# EAGLE design polarshield v1.4a (EAGLE 6.4)
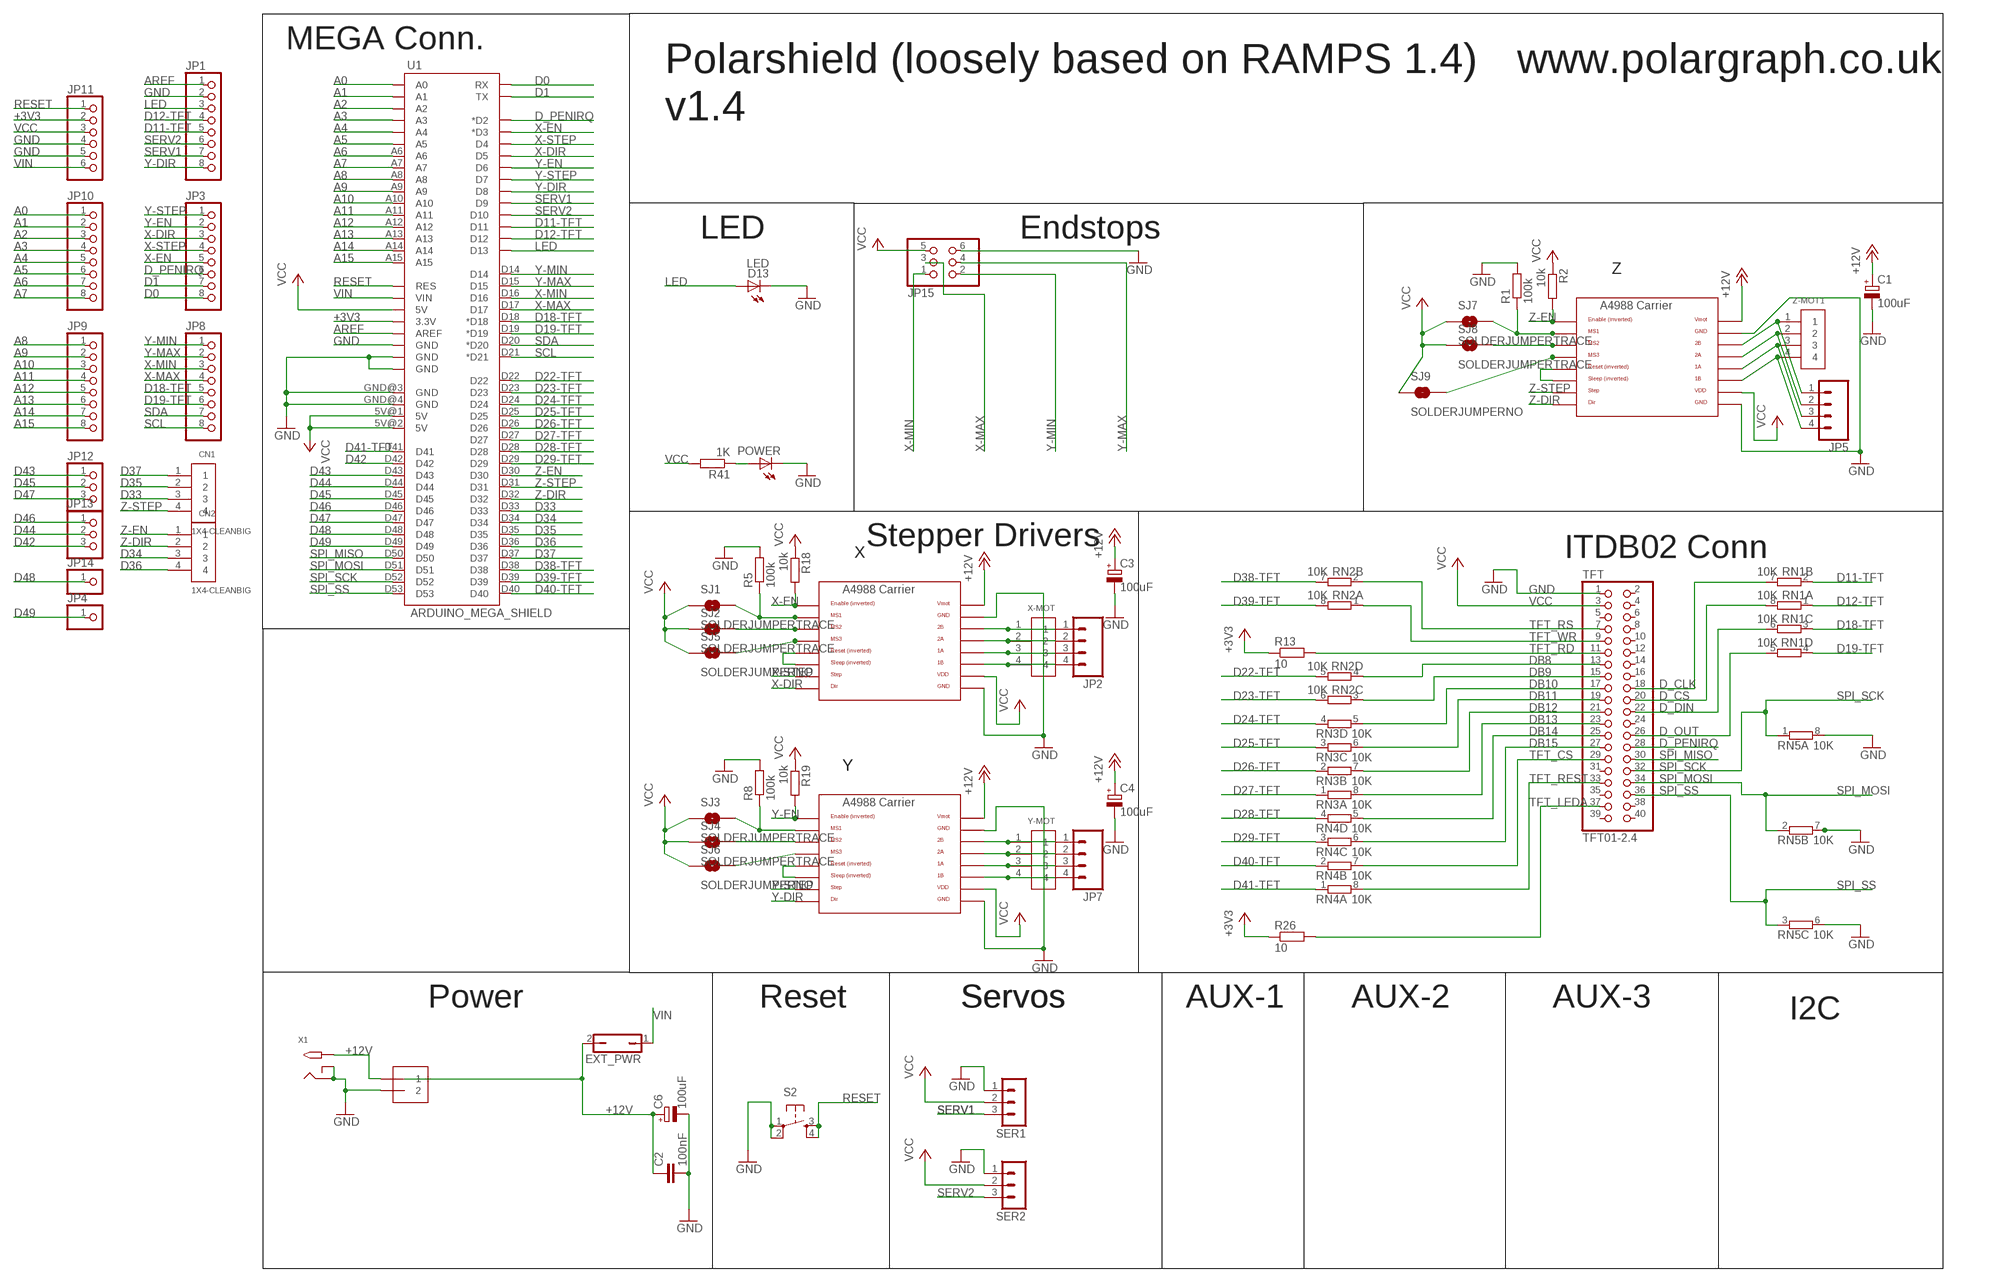
[diagram p0: schematic, sheet 1]

## Parts
C1  100uF  CPOL-EU153CLV-0605  [153CLV-0605]
C2  100nF  C-EUC0805  [C0805]
C3  100uF  CPOL-EU153CLV-0605  [153CLV-0605]
C4  100uF  CPOL-EU153CLV-0605  [153CLV-0605]
C6  100uF  CPOL-EU153CLV-0605  [153CLV-0605]
CN1  1X4-CLEANBIG  [1X04-CLEANBIG]
CN2  1X4-CLEANBIG  [1X04-CLEANBIG]
D13  LED  LEDCHIP-LED0805  [CHIP-LED0805]
EXT_PWR  JP1Q  [JP1]
J1  1X2-3.5MM  [1X2-3.5MM]
JP1  PINHD-1X8CLEANBIG  [1X08-CLEANBIG]
JP2  M04SCREW  [SCREWTERMINAL-3.5MM-4]
JP3  PINHD-1X8CLEANBIG  [1X08-CLEANBIG]
JP4  PINHD-1X1CB  [1X01-CLEANBIG]
JP5  M04SCREW  [SCREWTERMINAL-3.5MM-4]
JP7  M04SCREW  [SCREWTERMINAL-3.5MM-4]
JP8  PINHD-1X8CLEANBIG  [1X08-CLEANBIG]
JP9  PINHD-1X8CLEANBIG  [1X08-CLEANBIG]
JP10  PINHD-1X8CLEANBIG  [1X08-CLEANBIG]
JP11  PINHD-1X6CB  [1X06-CLEANBIG]
JP12  PINHD-1X3CB  [1X03-CLEANBIG]
JP13  PINHD-1X3CB  [1X03-CLEANBIG]
JP14  PINHD-1X1CB  [1X01-CLEANBIG]
JP15  PINHD-2X3  [2X03]
POWER  LEDCHIP-LED0805  [CHIP-LED0805]
R1  100k  R-EU_R0805  [R0805]
R2  10k  R-EU_R0805  [R0805]
R5  100k  R-EU_R0805  [R0805]
R8  100k  R-EU_R0805  [R0805]
R13  10  R-EU_R0805  [R0805]
R18  10k  R-EU_R0805  [R0805]
R19  10k  R-EU_R0805  [R0805]
R26  10  R-EU_R0805  [R0805]
R41  1K  R-EU_R0805  [R0805]
RN1  10K  4R-NEXBS8V  [EXBS8V]
RN2  10K  4R-NEXBS8V  [EXBS8V]
RN3  10K  4R-NEXBS8V  [EXBS8V]
RN4  10K  4R-NEXBS8V  [EXBS8V]
RN5  10K  4R-NEXBS8V  [EXBS8V]
S2  TAC_SWITCHPTH  [TACTILE-PTH]
SER1  3PIN-HEADER  [3PIN-HEADER]
SER2  3PIN-HEADER  [3PIN-HEADER]
SJ1  SOLDERJUMPERTRACE  [SJ_2S-TRACE]
SJ2  SOLDERJUMPERTRACE  [SJ_2S-TRACE]
SJ3  SOLDERJUMPERTRACE  [SJ_2S-TRACE]
SJ4  SOLDERJUMPERTRACE  [SJ_2S-TRACE]
SJ5  SOLDERJUMPERNO  [SJ_2S-NO]
SJ6  SOLDERJUMPERNO  [SJ_2S-NO]
SJ7  SOLDERJUMPERTRACE  [SJ_2S-TRACE]
SJ8  SOLDERJUMPERTRACE  [SJ_2S-TRACE]
SJ9  SOLDERJUMPERNO  [SJ_2S-NO]
TFT  TFT01-2.4  [TFT01-2.4]
U1  ARDUINO_MEGA_SHIELD  [ARDUINO_MEGA_SHIELD]
U$1  A4988BREAKOUT  [A4988BREAKOUT]
U$6  A4988BREAKOUT  [A4988BREAKOUT]
U$7  A4988BREAKOUT  [A4988BREAKOUT]
X1  2.1MMJACKTHM  [PJ-102A]
X-MOT  1X4-BIG  [1X04-BIG]
Y-MOT  1X4-BIG  [1X04-BIG]
Z-MOT1  1X4-BIG  [1X04-BIG]

## Nets
+3V3: JP11.2 R13.1 R26.1 U1.3.3V
+12V [vcc]: C1.+ C2.1 C3.+ C4.+ C6.+ EXT_PWR.2 J1.1 U$1.VMOT U$6.VMOT U$7.VMOT X1.TIP
A0: JP10.1 U1.A0
A1: JP10.2 U1.A1
A2: JP10.3 U1.A2
A3: JP10.4 U1.A3
A4: JP10.5 U1.A4
A5: JP10.6 U1.A5
A6: JP10.7 U1.A6
A7: JP10.8 U1.A7
A8: JP9.1 U1.A8
A9: JP9.2 U1.A9
A10: JP9.3 U1.A10
A11: JP9.4 U1.A11
A12: JP9.5 U1.A12
A13: JP9.6 U1.A13
A14: JP9.7 U1.A14
A15: JP9.8 U1.A15
AREF: JP1.1 U1.AREF
D0: JP3.8 U1.RX
D1: JP3.7 U1.TX
D11-TFT: JP1.5 RN1.2 U1.D11
D12-TFT: JP1.4 RN1.1 U1.D12
D18-TFT: JP8.5 RN1.3 U1.D18(*D18)
D19-TFT [signal]: JP8.6 RN1.4 U1.D19(*D19)
D22-TFT: RN2.5 U1.D22
D23-TFT: RN2.6 U1.D23
D24-TFT: RN3.4 U1.D24
D25-TFT: RN3.3 U1.D25
D26-TFT: RN3.2 U1.D26
D27-TFT: RN3.1 U1.D27
D28-TFT: RN4.4 U1.D28
D29-TFT: RN4.3 U1.D29
D33: CN1.3 U1.D33
D34: CN2.3 U1.D34
D35: CN1.2 U1.D35
D36: CN2.4 U1.D36
D37: CN1.1 U1.D37
D38-TFT: RN2.7 U1.D38
D39-TFT: RN2.8 U1.D39
D40-TFT: RN4.2 U1.D40
D41-TFT: RN4.1 U1.D41
D42: JP13.3 U1.D42
D43: JP12.1 U1.D43
D44: JP13.2 U1.D44
D45: JP12.2 U1.D45
D46: JP13.1 U1.D46
D47: JP12.3 U1.D47
D48: JP14.1 U1.D48
D49: JP4.1 U1.D49
D_CLK: RN1.7 TFT.18
D_CS: RN1.8 TFT.20
D_DIN: RN1.6 TFT.22
D_OUT: RN1.5 TFT.26
D_PENIRQ: JP3.6 TFT.28 U1.D2(*D2)
DB8: RN2.4 TFT.13
DB9: RN2.3 TFT.15
DB10: RN3.5 TFT.17
DB11: RN3.6 TFT.19
DB12: RN3.7 TFT.21
DB13: RN3.8 TFT.23
DB14: RN4.5 TFT.25
DB15: RN4.6 TFT.27
GND: C1.- C2.2 C3.- C4.- C6.- D13.C J1.2 JP1.2 JP11.4 JP11.5 JP15.6 POWER.C R1.2 R5.2 R8.2 RN5.6 RN5.7 RN5.8 S2.1 S2.2 SER1.1 SER2.1 TFT.1 U1.GND@0(GND) U1.GND@1(GND) U1.GND@2(GND) U1.GND@3(GND) U1.GND@4(GND) U$1.GND U$1.GND@0(GND) U$6.GND U$6.GND@0(GND) U$7.GND U$7.GND@0(GND) X1.RING X1.RING_SW
LED: D13.A JP1.3 U1.D13
N$1: U$6.RST U$6.SLP(SLEEP)
N$2: POWER.A R41.1
N$3: R5.1 SJ1.2 U$6.MS1
N$4: JP5.1 U$1.2B Z-MOT1.1
N$5: JP5.2 U$1.2A Z-MOT1.2
N$6: JP5.3 U$1.1A Z-MOT1.3
N$7: JP5.4 U$1.1B Z-MOT1.4
N$8: U$1.RST U$1.SLP(SLEEP)
N$9: R1.1 SJ7.2 U$1.MS1
N$10: SJ2.2 U$6.MS2
N$11: SJ8.2 U$1.MS2
N$12: SJ5.2 U$6.MS3
N$13: U$7.RST U$7.SLP(SLEEP)
N$14: SJ9.2 U$1.MS3
N$17: SJ4.2 U$7.MS2
N$21: JP2.1 U$6.2B X-MOT.1
N$22: JP2.2 U$6.2A X-MOT.2
N$26: JP2.3 U$6.1A X-MOT.3
N$27: JP2.4 U$6.1B X-MOT.4
N$28: JP7.1 U$7.2B Y-MOT.1
N$29: JP7.2 U$7.2A Y-MOT.2
N$30: JP7.3 U$7.1A Y-MOT.3
N$31: SJ6.2 U$7.MS3
N$33: R8.1 SJ3.2 U$7.MS1
N$36: JP7.4 U$7.1B Y-MOT.4
RESET: JP11.1 S2.3 S2.4 U1.RES
SCL: JP8.8 U1.D21(*D21)
SDA: JP8.7 U1.D20(*D20)
SERV1: JP1.7 SER1.3 U1.D9
SERV2: JP1.6 SER2.3 U1.D10
SPI_MISO: TFT.30 U1.D50
SPI_MOSI: RN5.2 TFT.34 U1.D51
SPI_SCK: RN5.1 TFT.32 U1.D52
SPI_SS: RN5.3 TFT.36 U1.D53
TFT_CS: RN4.7 TFT.29
TFT_LEDA: R26.2 TFT.37
TFT_RD: R13.2 TFT.11
TFT_REST: RN4.8 TFT.33
TFT_RS: RN2.2 TFT.7
TFT_WR: RN2.1 TFT.9
VCC: JP11.3 JP15.5 R2.1 R18.1 R19.1 R41.2 SER1.2 SER2.2 SJ1.1 SJ2.1 SJ3.1 SJ4.1 SJ5.1 SJ6.1 SJ7.1 SJ8.1 SJ9.1 TFT.3 U1.5V@0(5V) U1.5V@1(5V) U1.5V@2(5V) U$1.VDD U$6.VDD U$7.VDD
VIN [vcc]: EXT_PWR.1 JP11.6 U1.VIN
X-DIR: JP3.3 U1.D5 U$6.DIR
X-EN: JP3.5 R18.2 U1.D3(*D3) U$6.EN
X-MAX: JP8.4 JP15.3 U1.D17
X-MIN: JP8.3 JP15.1 U1.D16
X-STEP: JP3.4 U1.D4 U$6.STEP
Y-DIR: JP1.8 U1.D8 U$7.DIR
Y-EN: JP3.2 R19.2 U1.D6 U$7.EN
Y-MAX: JP8.2 JP15.4 U1.D15
Y-MIN: JP8.1 JP15.2 U1.D14
Y-STEP: JP3.1 U1.D7 U$7.STEP
Z-DIR: CN2.2 U1.D32 U$1.DIR
Z-EN: CN2.1 R2.2 U1.D30 U$1.EN
Z-STEP: CN1.4 U1.D31 U$1.STEP
Unconnected: RN5.4 RN5.5 TFT.2 TFT.4 TFT.5 TFT.6 TFT.8 TFT.10 TFT.12 TFT.14 TFT.16 TFT.24 TFT.31 TFT.35 TFT.38 TFT.39 TFT.40

## Notes on the sheet
- MEGA Conn.
- Polarshield (loosely based on RAMPS 1.4) | www.polargraph.co.uk
- v1.4
- LED | Endstops
- Z
- Stepper Drivers
- X | ITDB02 Conn
- Y
- Power | Reset | Servos | Servos | AUX-1 | AUX-2 | AUX-3
- I2C

## Library data of the parts
C1 C3 C4 C6 = rcl:CPOL-EU: POLARIZED CAPACITOR, European symbol
C2 = resistor:C-EU: CAPACITOR, European symbol
CN1 CN2 X-MOT Y-MOT Z-MOT1 = adafruit:1X4: 4-pin connector
D13 POWER = led:LED: LED OSRAM: - CHIPLED LG R971, LG N971, LY N971, LG Q971, LY Q971, LO R971, LY R971 LH N974, LH R974 LS Q976, LO Q976, LY Q976 LO Q996 - Hyper CHIPLED LW Q18S LB Q993, LB Q99A, LB R99A - SideLED LS A670, LO A670, LY A670, LG A670, LP A670 LB A673, LV A673, LT A673, LW A673 LH A674 LY A675 LS A676, LA A676, LO A676, LY A676, LW A676 LS A679, LY A679, LG A679 - Hyper Micro SIDELED® LS Y876, LA Y876, LO Y876, LY Y876 LT Y87S - SmartLED LW L88C, LW L88S LB L89C, LB L89S, LG L890 LS L89K, LO L89K, LY L89K LS L896, LA L896, LO L896, LY L896 - TOPLED LS T670, LO T670, LY T670, LG T670, LP T670 LSG T670, LSP T670, LSY T670, LOP T670, LYG T670 LG T671, LOG T671, LSG T671 LB T673, LV T673, LT T673, LW T673 LH T674 LS T676, LA T676, LO T676, LY T676, LB T676, LH T676, LSB T676, LW T676 LB T67C, LV T67C, LT T67C, LS T67K, LO T67K, LY T67K, LW E67C LS E67B, LA E67B, LO E67B, LY E67B, LB E67C, LV E67C, LT E67C LW T67C LS T679, LY T679, LG T679 LS T770, LO T770, LY T770, LG T770, LP T770 LB T773, LV T773, LT T773, LW T773 LH T774 LS E675, LA E675, LY E675, LS T675 LS T776, LA T776, LO T776, LY T776, LB T776 LHGB T686 LT T68C, LB T68C - Hyper Mini TOPLED® LB M676 - Mini TOPLED Santana® LG M470 LS M47K, LO M47K, LY M47K Source: http://www.osram.convergy.de LUXEON: - LUMILED® LXK2-PW12-R00, LXK2-PW12-S00, LXK2-PW14-U00, LXK2-PW14-V00 LXK2-PM12-R00, LXK2-PM12-S00, LXK2-PM14-U00 LXK2-PE12-Q00, LXK2-PE12-R00, LXK2-PE12-S00, LXK2-PE14-T00, LXK2-PE14-U00 LXK2-PB12-K00, LXK2-PB12-L00, LXK2-PB12-M00, LXK2-PB14-N00, LXK2-PB14-P00, LXK2-PB14-Q00 LXK2-PR12-L00, LXK2-PR12-M00, LXK2-PR14-Q00, LXK2-PR14-R00 LXK2-PD12-Q00, LXK2-PD12-R00, LXK2-PD12-S00 LXK2-PH12-R00, LXK2-PH12-S00 LXK2-PL12-P00, LXK2-PL12-Q00, LXK2-PL12-R00 Source: www.luxeon.com KINGBRIGHT: KA-3528ASYC Source: www.kingbright.com
EXT_PWR = jumper:JP1Q: JUMPER
J1 = adafruit:1X2: 3.5mm Terminal block http://www.ladyada.net/library/pcb/eaglelibrary.html
JP1 JP3 JP8-JP10 = adafruit:PINHD-1X8: PIN HEADER
JP2 JP5 JP7 = SparkFun:M04: Header 4 Standard 4-pin 0.1" header. Use with straight break away headers (SKU : PRT-00116), right angle break away headers (PRT-00553), swiss pins (PRT-00743), machine pins (PRT-00117), and female headers (PRT-00115). Molex polarized connector foot print use with SKU : PRT-08231 with associated crimp pins and housings. 1MM SMD Version SKU: PRT-10208
JP4 JP14 = adafruit:PINHD-1X1: Pin header 1x1 for 0.1" spacing With round pins
JP11 = adafruit:PINHD-1X6: PIN HEADER
JP12 JP13 = adafruit:PINHD-1X3: PIN HEADER
JP15 = pinhead:PINHD-2X3: PIN HEADER
R1 R2 R5 R8 R18 R19 R41 = rcl:R-EU_: RESISTOR, European symbol
R13 R26 = resistor:R-EU_: RESISTOR, European symbol
RN1-RN5 = resistor-dil:4R-N: Array Chip Resistor Source: RS Component / Phycomp; OC_FARNELL: unknown; OC_NEWARK: unknown
S2 = SparkFun:TAC_SWITCH: Momentary Switch Button commonly used for reset or general input. Spark Fun Electronics SKU : COM-00097
SER1 SER2 = ultimachine:3PIN-HEADER: PIN HEADER
SJ1-SJ9 = SparkFun:SOLDERJUMPER: Solder Jumper Standard SMD solder jumper. Used to automate production. Two varients : Normally Open and Normally Closed are the same, but have different paste layers. NC will have a large amount of paste and should jumper during reflow.
TFT = sandy:TFT01-2.4
U1 = RepRapjr:ARDUINO_MEGA_SHIELD
U$1 U$6 U$7 = RepRapjr:A4988BREAKOUT
X1 = adafruit:2.1MMJACK: 2.1mm x 5.5mm THM DC jack with internal switch. Digikey part #PJ-102A, 4UCON part #05537 2.1mm x 5.5mm SMT DC jack with internal switch. Digikey part #PJ-002A-SMT, 4UCON part #03267 By microbuilder.eu & adafruit.com

## Net classes
1 gnd12: width 2.54 mm
2 gnd5: width 2.54 mm
3 vmot: width 2.54 mm
4 vcc: width 0.406 mm
5 signal: width 0.406 mm

## Board
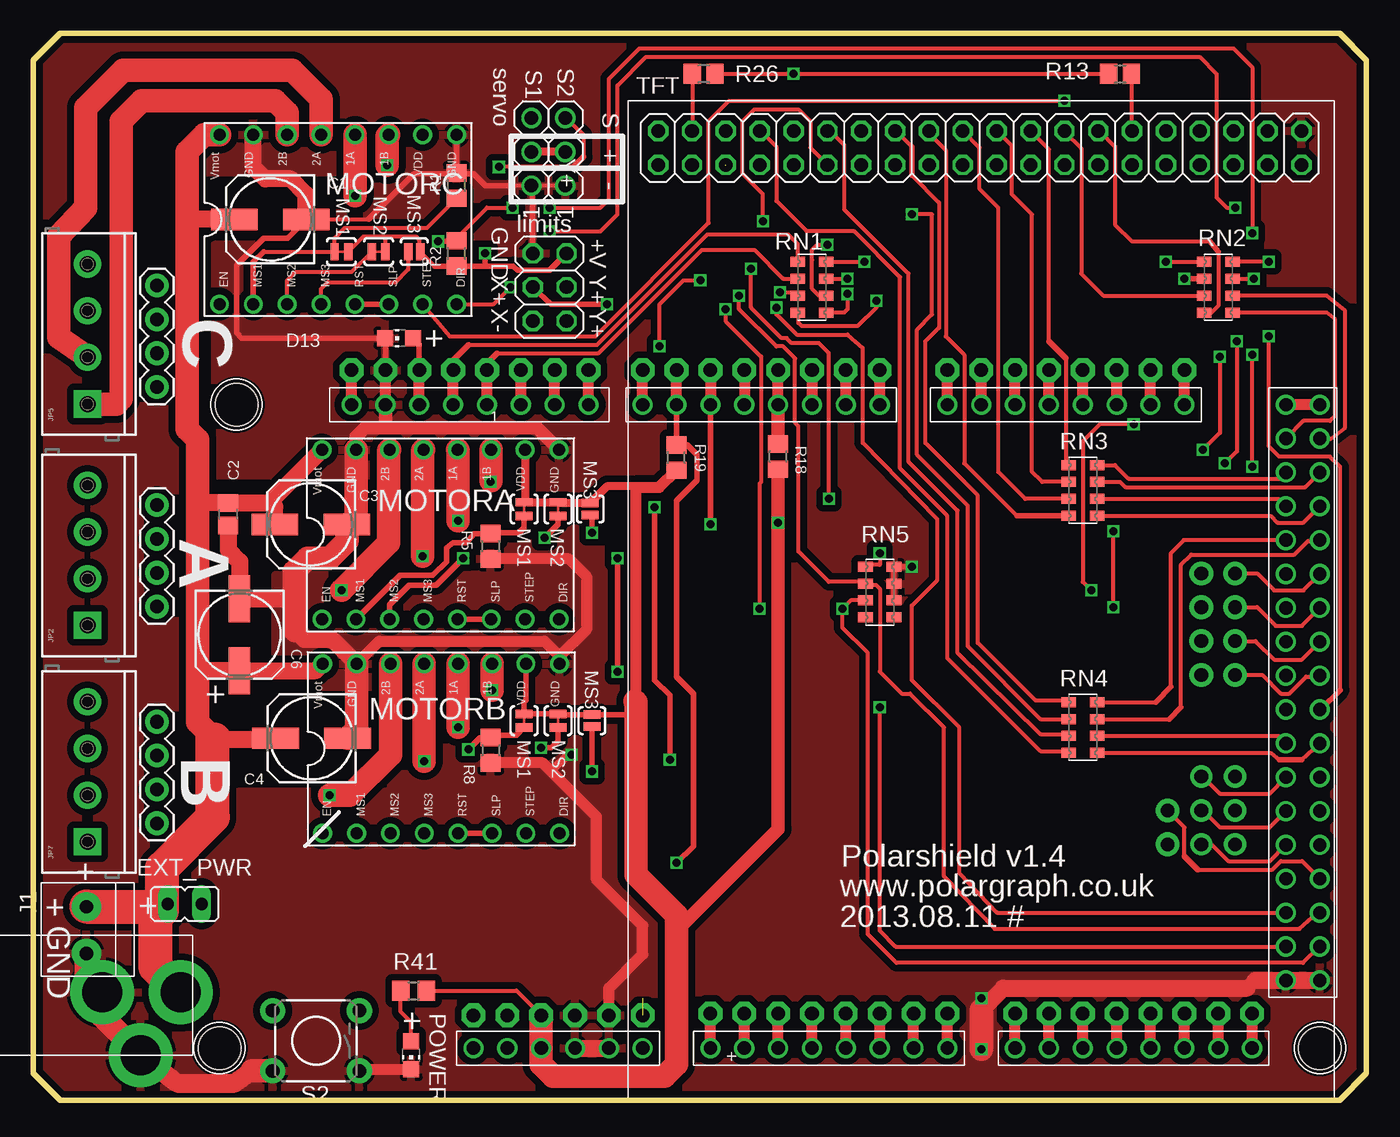
[diagram p1: board, top side]
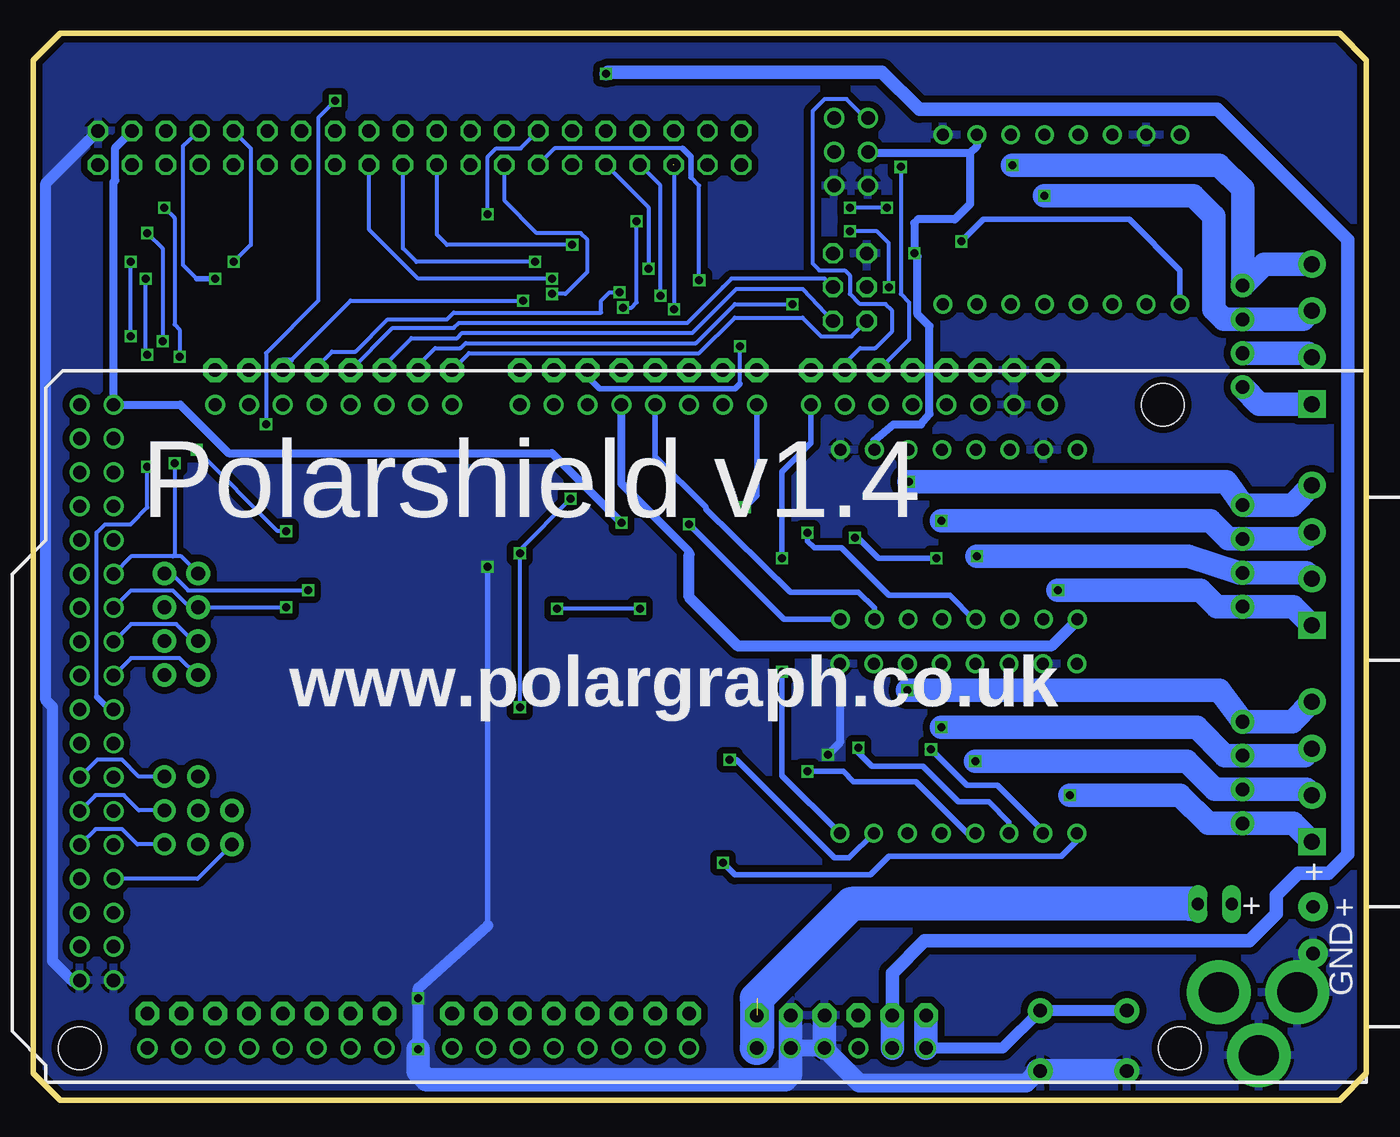
[diagram p2: board, bottom side, seen from below]

Size 100 x 80 mm. Coordinates in mm from the lower left corner, seen from the top.
Outline: 100,2 100,78 98,80 2,80 0,78 0,2 2,0 98,0 100,2
Copper layers (1*16): Top 0.035mm / dielectric 1.5mm / Bottom 0.035mm
Design rules "ITead_rule": minimum track width 6mil, minimum drill 12mil, track to track 6mil, track to pad 6mil, pad to pad 6mil, via to via 6mil, smd to smd 0mil, copper to edge 10mil, drill to drill 10mil, minimum pad ring 10mil, minimum via ring 6mil, stop-mask expansion 2mil, vias tented up to drill 100mil, thermal gap 10mil

### Footprints (pad centres in the part's own frame; a part is rotated, then mirrored left to right if it is on the bottom)
153CLV-0605 = smd 3.5 x 1.6: + 2.7,0; - -2.7,0
C0805 = smd 1.3 x 1.5: 1 -0.85,0; 2 0.85,0
1X04-CLEANBIG = drill 1.016 pad 1.778: 1 -3.81,0; 2 -1.27,0; 3 1.27,0; 4 3.81,0
CHIP-LED0805 = smd 1.2 x 1.2: A 0,-1.05; C 0,1.05
JP1 = drill 0.914 long: 1 0,-1.27; 2 0,1.27
1X2-3.5MM = drill 1 pad 2.184: 1 1.8,0; 2 -1.7,0
1X08-CLEANBIG = drill 1.016 pad 1.778 octagon: 1 -8.89,0; 2 -6.35,0; 3 -3.81,0; 4 -1.27,0; 5 1.27,0; 6 3.81,0; 7 6.35,0; 8 8.89,0
SCREWTERMINAL-3.5MM-4 = drill 1.2 pad 2.032 square: 1 0,0 | drill 1.2 pad 2.032: 2 3.5,0; 3 7,0; 4 10.5,0
1X01-CLEANBIG = drill 1.016 pad 1.778: 1 0,0
1X06-CLEANBIG = drill 1.016 pad 1.778 octagon: 1 -6.35,0; 2 -3.81,0; 3 -1.27,0; 4 1.27,0; 5 3.81,0; 6 6.35,0
1X03-CLEANBIG = drill 1.016 pad 1.676: 1 -2.54,0; 2 0,0; 3 2.54,0
2X03 = drill 1.016 octagon: 1 -2.54,-1.27; 2 -2.54,1.27; 3 0,-1.27; 4 0,1.27; 5 2.54,-1.27; 6 2.54,1.27
R0805 = smd 1.3 x 1.5: 1 -0.95,0; 2 0.95,0
R0805' = smd 1.3 x 1.5: 1 -0.85,0; 2 0.85,0
EXBS8V = smd 0.75 x 1.1: 1 -1.905,-1.07; 2 -0.635,-1.07; 3 0.635,-1.07; 4 1.905,-1.07; 5 1.905,1.07; 6 0.635,1.07; 7 -0.635,1.07; 8 -1.905,1.07
TACTILE-PTH = drill 1.016 pad 1.88: 1 -3.251,2.261; 2 3.251,2.261; 3 -3.251,-2.261; 4 3.251,-2.261
3PIN-HEADER = drill 1.016: 1 -2.54,0; 2 0,0; 3 2.54,0
SJ_2S-TRACE = smd 0.635 x 1.27: 1 -0.508,0; 2 0.508,0
SJ_2S-NO = smd 0.635 x 1.27: 1 -0.45,0; 2 0.45,0
TFT01-2.4 = drill 1.016 octagon: 1 0.98,24.02; 2 3.52,24.02; 3 0.98,21.48; 4 3.52,21.48; 5 0.98,18.94; 6 3.52,18.94; 7 0.98,16.4; 8 3.52,16.4; 9 0.98,13.86; 10 3.52,13.86; 11 0.98,11.32; 12 3.52,11.32; 13 0.98,8.78; 14 3.52,8.78; 15 0.98,6.24; 16 3.52,6.24; 17 0.98,3.7; 18 3.52,3.7; 19 0.98,1.16; 20 3.52,1.16; 21 0.98,-1.38; 22 3.52,-1.38; 23 0.98,-3.92; 24 3.52,-3.92; 25 0.98,-6.46; 26 3.52,-6.46; 27 0.98,-9; 28 3.52,-9; 29 0.98,-11.54; 30 3.52,-11.54; 31 0.98,-14.08; 32 3.52,-14.08; 33 0.98,-16.62; 34 3.52,-16.62; 35 0.98,-19.16; 36 3.52,-19.16; 37 0.98,-21.7; 38 3.52,-21.7; 39 0.98,-24.24; 40 3.52,-24.24
ARDUINO_MEGA_SHIELD = drill 1 pad 1.422: 3.3V 35.56,2.54; 5V@0 38.1,2.54; 5V@1 93.98,50.8; 5V@2 96.52,50.8; A0 50.8,2.54; A1 53.34,2.54; A2 55.88,2.54; A3 58.42,2.54; A4 60.96,2.54; A5 63.5,2.54; A6 66.04,2.54; A7 68.58,2.54; A8 73.66,2.54; A9 76.2,2.54; A10 78.74,2.54; A11 81.28,2.54; A12 83.82,2.54; A13 86.36,2.54; A14 88.9,2.54; A15 91.44,2.54; AREF 23.876,50.8; D2 58.42,50.8; D3 55.88,50.8; D4 53.34,50.8; D5 50.8,50.8; D6 48.26,50.8; D7 45.72,50.8; D8 41.656,50.8; D9 39.116,50.8; D10 36.576,50.8; D11 34.036,50.8; D12 31.496,50.8; D13 28.956,50.8; D14 68.58,50.8; D15 71.12,50.8; D16 73.66,50.8; D17 76.2,50.8; D18 78.74,50.8; D19 81.28,50.8; D20 83.82,50.8; D21 86.36,50.8; D22 93.98,48.26; D23 96.52,48.26; D24 93.98,45.72; D25 96.52,45.72; D26 93.98,43.18; D27 96.52,43.18; D28 93.98,40.64; D29 96.52,40.64; D30 93.98,38.1; D31 96.52,38.1; D32 93.98,35.56; D33 96.52,35.56; D34 93.98,33.02; D35 96.52,33.02; D36 93.98,30.48; D37 96.52,30.48; D38 93.98,27.94; D39 96.52,27.94; D40 93.98,25.4; D41 96.52,25.4; D42 93.98,22.86; D43 96.52,22.86; D44 93.98,20.32; D45 96.52,20.32; D46 93.98,17.78; D47 96.52,17.78; D48 93.98,15.24; D49 96.52,15.24; D50 93.98,12.7; D51 96.52,12.7; D52 93.98,10.16; D53 96.52,10.16; GND@0 40.64,2.54; GND@1 43.18,2.54; GND@2 26.416,50.8; GND@3 93.98,7.62; GND@4 96.52,7.62; RES 33.02,2.54; RX 63.5,50.8; TX 60.96,50.8; VIN 45.72,2.54 | hole 3.2: 96.52,2.54; 13.97,2.54; 15.24,50.8
A4988BREAKOUT = drill 0.9: 1A 8.89,1.27; 1B 11.43,1.27; 2A 6.35,1.27; 2B 3.81,1.27; DIR 16.51,-11.43; EN -1.27,-11.43; GND 16.51,1.27; GND@0 1.27,1.27; MS1 1.27,-11.43; MS2 3.81,-11.43; MS3 6.35,-11.43; RST 8.89,-11.43; SLP 11.43,-11.43; STEP 13.97,-11.43; VDD 13.97,1.27; VMOT -1.27,1.27
PJ-102A = drill 3 pad 4.8: RING 0.1,-3.39; RING_SW -4.6,-6.29; TIP 0.1,-9.29
1X04-BIG = drill 1.016 pad 1.778: 1 0,0; 2 2.54,0; 3 5.08,0; 4 7.62,0

### Placement (x,y rotation side)
C1  17.78,66.04 180 top
C2  14.62,43.93 270 top
C3  20.83,43.17 180 top
C4  20.89,27.13 180 top
C6  15.47,34.89 270 top
CN1  90.17,35.69 90 top
CN2  87.63,35.69 270 bottom
D13  27.43,57.15 90 top
EXT_PWR  11.36,14.71 90 top
J1  3.99,12.7 90 top
JP1  32.77,54.74 0 top
JP2  4.06,35.6 90 top
JP3  54.61,54.74 0 top
JP4  85.09,21.72 0 top
JP5  4.06,52.2 90 top
JP7  4.06,19.36 90 top
JP8  77.47,54.74 0 top
JP9  82.55,6.48 0 top
JP10  59.69,6.48 0 top
JP11  39.37,6.35 0 top
JP12  90.17,21.72 270 bottom
JP13  87.63,21.72 90 top
JP14  85.09,19.18 0 top
JP15  38.73,60.96 90 top
POWER  28.34,3.35 180 top
R1  31.75,68.58 90 top
R2  31.75,63.5 90 top
R5  34.29,41.53 270 top
R8  34.32,26.23 270 top
R13  10  [R0805']  81.53,76.96 0 top
R18  55.88,48.26 90 top
R19  48.24,48.18 90 top
R26  10  [R0805']  50.29,76.96 180 top
R41  28.53,8.21 0 top
RN1  58.42,60.96 270 top
RN2  88.9,60.96 270 top
RN3  78.74,45.72 90 top
RN4  78.74,27.94 90 top
RN5  63.5,38.1 270 top
S2  21.21,4.45 180 top
SER1  37.38,71.11 90 top
SER2  39.92,71.11 90 top
SJ1  36.83,44.32 270 top
SJ2  39.37,44.32 270 top
SJ3  36.83,28.45 270 top
SJ4  39.37,28.45 270 top
SJ5  41.78,44.32 270 top
SJ6  41.91,28.45 270 top
SJ7  23.11,63.63 180 top
SJ8  25.91,63.63 180 top
SJ9  28.57,63.63 180 top
TFT  71.12,73.66 270 top
U1  0,1.35 0 top
U$1  15.24,71.12 0 top
U$6  22.93,47.49 0 top
U$7  22.98,31.44 0 top
X1  1.77,7.97 90 top
X-MOT  9.27,37 90 top
Y-MOT  9.27,20.75 90 top
Z-MOT1  9.27,53.47 90 top

### Tracks (layer width: path | path; a pad name or v marks a point on that pad's centre or on a via)
+3V3  (via drill 0.6)
  Top 0.305: R26.1 56.52,76.96 v57.02,76.96 R13.1
  Bottom 1.016: JP11.2 35.56,9.53 33.15,11.94 8.76,11.94 6.73,13.97 6.73,15.37 5.08,17.02 2.79,17.02 1.4,18.41 1.4,64.52 11.18,74.3 33.53,74.3 36.32,77.09 56.9,77.09 v57.02,76.96
  Bottom 1.778: JP11.2 U1.3.3V
+12V
  Top 0.813: 9.65,14.22 10.09,14.66 EXT_PWR.2
  Top 1.27: EXT_PWR.2 9.17,14.71 9.14,14.73 | C4.+ 18.11,27.05 13.59,27.05 | C3.+ 18.12,43.18 18.12,44.49 17.76,44.85 | C1.+ 11.56,66.04 | 17.76,44.85 17.68,44.78 C2.1 12.5,44.78 12.32,44.96 | 17.76,44.85 U$6.VMOT | 12.32,32.26 12.38,32.19 C6.+ 21.19,32.19 U$7.VMOT
  Top 1.778: U$1.VMOT 12.83,72.39 11.56,71.12 11.56,66.04 11.56,50.29 12.32,49.53 12.32,44.96 12.32,32.26 12.32,28.32 13.59,27.05
  Top 2.54: 9.14,14.61 9.14,9.99 X1.TIP | 9.14,14.61 9.14,14.73 | J1.1 9.04,14.5 9.14,14.61 | 9.65,14.22 9.65,17.4 13.46,21.21 13.44,21.23 13.44,27.05 13.59,27.05
A0
  Top 0.813: U1.A0 JP10.1
A1
  Top 0.813: U1.A1 JP10.2
A2
  Top 0.813: U1.A2 JP10.3
A3
  Top 0.813: U1.A3 JP10.4
A4
  Top 0.813: U1.A4 JP10.5
A5
  Top 0.813: U1.A5 JP10.6
A6
  Top 0.813: U1.A6 JP10.7
A7
  Top 0.813: U1.A7 JP10.8
A8
  Top 0.813: U1.A8 JP9.1
A9
  Top 0.813: U1.A9 JP9.2
A10
  Top 0.813: U1.A10 JP9.3
A11
  Top 0.813: U1.A11 JP9.4
A12
  Top 0.813: U1.A12 JP9.5
A13
  Top 0.813: U1.A13 JP9.6
A14
  Top 0.813: U1.A14 JP9.7
A15
  Top 0.813: U1.A15 JP9.8
AREF
  Top 0.813: U1.AREF JP1.1
D0
  Top 0.813: U1.RX JP3.8
D1
  Top 0.813: U1.TX JP3.7
D11-TFT
  Top 0.305: 34.8,56.01 42.42,56.01 50.16,63.75 54.1,63.75 56.26,61.59 RN1.2
  Top 0.406: JP1.5 34.04,55.24 34.8,56.01
  Top 0.813: U1.D11 JP1.5
D12-TFT
  Top 0.305: 32.64,56.64 42.29,56.64 50.55,64.9 56.64,64.9 57.35,64.19 RN1.1
  Top 0.406: JP1.4 31.5,55.5 32.64,56.64
  Top 0.813: U1.D12 JP1.4
D18-TFT  (via drill 0.6)
  Top 0.305: v56.01,60.58 57.1,60.58 RN1.3
  Top 0.813: U1.D18 JP8.5
  Bottom 0.305: JP8.5 78.74,54.99 77.6,56.13 75.82,56.13 73.41,58.55 68.96,58.55 68.45,59.05 57.4,59.05 57.4,59.94 56.77,60.58 v56.01,60.58
D19-TFT  (via drill 0.6)
  Top 0.305: 57.4,59 57.4,58.29 57.66,58.04 61.85,58.04 63.25,59.44 v63.25,59.94
  Top 0.406: 57.4,59 RN1.4
  Top 0.813: U1.D19 JP8.6
  Bottom 0.305: 80.64,55.5 76.2,59.94 v63.25,59.94
  Bottom 0.406: JP8.6 81.28,55.5 80.64,55.5
D22-TFT
  Top 0.305: U1.D22 95.3,50.93 97.28,50.93 97.66,51.31 97.66,58.55 97.03,59.05 RN2.5
D23-TFT
  Top 0.305: U1.D23 97.36,49.61 98.42,50.42 98.42,59.18 97.03,60.33 RN2.6
D24-TFT
  Top 0.305: RN3.4 81.15,47.62 82.17,46.61 93.52,46.61 U1.D24
D25-TFT
  Top 0.305: RN3.3 81.53,46.35 81.92,45.97 95.42,45.97 U1.D25
D26-TFT
  Top 0.305: RN3.2 93.42,45.09 U1.D26
D27-TFT
  Top 0.305: RN3.1 92.84,43.81 93.34,43.31 95.3,43.31 U1.D27
D28-TFT
  Top 0.305: RN4.4 84.2,29.84 | 85.34,30.99 85.34,41.02 86.31,41.99 U1.D28
  Top 0.406: 84.2,29.84 85.34,30.99
D29-TFT
  Top 0.305: RN4.3 85.22,28.57 | 86.11,29.46 86.11,40.13 86.87,40.89 94.61,40.89 95.63,41.91 96.44,41.91 U1.D29
  Top 0.406: 85.22,28.57 86.11,29.46
D33
  Top 0.305: CN1.3 91.82,36.96 93.22,35.56 95.17,35.56 U1.D33
D34
  Bottom 0.305: 88.01,34.42 89.28,35.69 92.66,35.69 U1.D34
  Bottom 0.406: CN2.3 88.01,34.42
D35
  Top 0.305: CN1.2 91.69,34.42 93.09,33.02 95.17,33.02 U1.D35
D36
  Bottom 0.305: 87.76,31.88 89.03,33.15 92.66,33.15 U1.D36
  Bottom 0.406: CN2.4 87.76,31.88
D37
  Top 0.305: CN1.1 92.2,31.88 93.6,30.48 94.23,30.48 95.5,31.75 96.44,31.75 U1.D37
D38-TFT  (via drill 0.6)
  Top 0.305: RN2.7 v91.57,61.59 | v91.44,47.5 v91.44,55.88
  Bottom 0.305: v91.44,47.5 91.44,44.45 92.71,43.18 94.61,43.18 95.25,42.55 95.25,30.23 | v91.44,55.88 91.57,56.01 v91.57,61.59
  Bottom 0.406: U1.D38 94.31,29.29 95.25,30.23
D39-TFT  (via drill 0.6)
  Top 0.305: 98.04,30.73 98.04,47.5 97.28,48.26 93.47,48.26 92.71,49.02 v92.71,57.28 | v92.71,62.87 RN2.8
  Top 0.406: U1.D39 96.6,29.29 98.04,30.73
  Bottom 0.305: v92.71,57.28 v92.71,62.87
D40-TFT
  Top 0.305: RN4.2 93.42,27.3 U1.D40
D41-TFT
  Top 0.305: RN4.1 92.84,26.04 93.47,25.53 | 95.17,25.53 U1.D41
  Top 0.406: 93.47,25.53 95.17,25.53
D42
  Top 0.305: 87.76,24.26 89.03,22.99 92.76,22.99 U1.D42
  Top 0.406: JP13.3 87.76,24.26
D43
  Bottom 0.305: JP12.1 92.08,24.26 93.34,25.53 95.2,25.53 U1.D43
D44
  Top 0.305: 87.76,21.72 89.03,20.45 92.76,20.45 U1.D44
  Top 0.406: JP13.2 87.76,21.72
D45
  Bottom 0.305: JP12.2 92.08,21.72 93.22,22.86 95.33,22.86 U1.D45
D46
  Top 0.305: JP13.1 88.39,19.18 89.66,17.91 92.76,17.91 U1.D46
D47
  Bottom 0.305: JP12.3 92.2,19.18 93.34,20.32 95.33,20.32 U1.D47
D48
  Bottom 0.305: U1.D48 87.68,16.59 JP14.1
D49
  Top 0.305: U1.D49 95.2,17.91 93.6,17.91 92.96,17.27 87.38,17.27 | 86.36,18.29 86.36,20.45 JP4.1
  Top 0.406: 87.38,17.27 86.36,18.29
D_CLK  (via drill 0.6)
  Top 0.305: RN1.7 v61.09,61.59
  Bottom 0.305: v61.09,61.59 71.12,61.59 74.8,65.28 74.8,70.12
  Bottom 0.406: 74.8,70.12 TFT.18
D_CS  (via drill 0.6)
  Top 0.305: RN1.8 v62.36,62.87
  Bottom 0.305: v62.36,62.87 71.25,62.87 72.26,63.88 72.26,70.12
  Bottom 0.406: 72.26,70.12 TFT.20
D_DIN  (via drill 0.6)
  Top 0.305: RN1.6 58.93,60.33 58.42,60.83 58.42,62.99 58.42,63.75 58.8,64.14 v59.56,64.14
  Bottom 0.305: v59.56,64.14 68.96,64.14 69.72,64.9 69.72,70.12
  Bottom 0.406: 69.72,70.12 TFT.22
D_OUT  (via drill 0.6)
  Top 0.305: v61.09,60.45 61.09,59.31 60.83,59.05 RN1.5
  Top 0.406: 64.64,70.12 TFT.26
  Bottom 0.305: 64.64,70.12 64.64,67.44 62.23,65.02 58.93,65.02 58.42,64.52 58.42,62.1 60.07,60.45 v61.09,60.45
  Bottom 0.406: 64.64,70.12 TFT.26
D_PENIRQ  (via drill 0.6)
  Top 0.305: v46.99,56.52 46.99,59.69 48.77,61.47 v50.04,61.47
  Top 0.813: JP3.6 U1.D2
  Bottom 0.305: 46.99,53.72 v46.99,56.52 | v50.04,61.47 50.04,68.58 50.67,69.22 | 51.31,71.37 60.89,71.37 TFT.28
  Bottom 0.406: JP3.6 58.42,54.23 57.53,53.34 47.37,53.34 46.99,53.72 | 50.67,69.22 50.67,70.74 51.31,71.37
DB8
  Top 0.305: 79.97,72.68 81.15,71.5 81.15,65.66 82.42,64.39 88.27,64.39 | 88.9,63.63 88.9,59.56 88.39,59.05 RN2.4
  Top 0.406: TFT.13 79.97,72.68 | 88.27,64.39 88.9,63.63
DB9
  Top 0.305: 77.36,72.63 78.61,71.37 78.61,61.98 80.26,60.33 RN2.3
  Top 0.406: TFT.15 77.36,72.63
DB10
  Top 0.305: 76.2,56.9 76.2,71.3 TFT.17 | 77.47,55.63 77.47,47.83
  Top 0.406: 76.2,56.9 77.47,55.63 | 77.47,47.83 RN3.5
DB11
  Top 0.305: RN3.6 75.69,46.35 74.93,47.12 74.93,66.42 73.41,67.94 73.41,71.55 TFT.19
DB12
  Top 0.305: RN3.7 74.42,45.09 72.39,47.12 72.39,66.93 70.99,68.33 70.99,71.43 TFT.21
DB13
  Top 0.305: TFT.23 67.2,72.5 68.45,71.25 68.45,57.28 69.85,55.88 69.85,47.75 73.79,43.81
  Top 0.406: 73.79,43.81 RN3.8
DB14
  Top 0.305: 77.54,29.97 75.18,29.97 70.87,34.29 70.87,45.34 66.93,49.28 66.93,56.9 67.94,57.91 67.94,67.31 65.91,69.34 | 64.73,72.68 65.91,71.5
  Top 0.406: 77.54,29.97 RN4.5 | TFT.25 64.73,72.68 | 65.91,71.5 65.91,69.34
DB15  (via drill 0.6)
  Top 0.305: RN4.6 75.56,28.57 70.1,34.04 70.1,44.58 66.29,48.39 66.29,57.78 67.44,58.93 67.44,66.42 v65.91,66.42
  Bottom 0.305: v65.91,66.42 65.91,70.74 65.28,71.37 63.43,71.37 TFT.27
GND  (via drill 0.6)
  Top 0.305: C1.- 25.15,66.04 | 31.69,69.47 R1.2 | SER1.1 36.08,68.57 | SER2.1 SER1.1 | SER1.1
  Top 0.406: RN5.6 RN5.7 RN5.8 v65.91,40.01 | 25.15,66.04 28.57,69.47 31.69,69.47 | U$1.GND R1.2 31.81,69.47 33.02,69.47 33.92,68.57 36.08,68.57 | JP1.2 26.42,57.12 D13.C 15.62,57.15 15.24,57.53 15.24,62.61 17.27,64.64 19.08,64.64 C1.- | JP15.6 37.47,68.48 SER1.1
  Top 0.61: v40.39,25.91 40.13,25.91 38.86,24.64
  Top 0.813: 39.49,33.28 U$7.GND | 39.49,33.28 38.35,34.42 25.96,34.42 U$7.GND@0 | R8.2 38.22,25.28 38.86,24.64 42.23,21.27 42.23,16.57 45.72,13.08 45.72,10.92 43.18,8.38 JP11.5 | R5.2 40.19,40.58 41.53,39.24 41.53,35.32 39.49,33.28 | POWER.C 24.58,2.3 S2.1 | 91.06,8.38 91.65,8.97 | 72.39,8 72.77,8.38 | U1.GND@2 JP1.2
  Top 1.016: U$6.GND@0 24.2,49.73 24.89,50.42 26.42,50.42 | 26.42,50.42 37.78,50.42 U$6.GND | U1.GND@2 26.42,50.42
  Top 1.27: U1.GND@0 U1.GND@1 | 24.2,43.84 C3.- | 19.68,35.18 20.32,34.54 22.42,34.54 U$7.GND@0 | U1.GND@4 U1.GND@3 91.65,8.97 | 71.12,6.73 72.39,8 | 72.77,8.38 91.06,8.38 | C1.- 20.48,67.91 19.3,69.09 17.4,69.09 16.51,69.98 U$1.GND@0 | C2.2 14.62,41.26 15.49,40.39 15.49,37.62 C6.- 19.56,37.59
  Top 1.422: 16.41,2.18 15.11,1.27 10.79,1.27 X1.RING_SW
  Top 1.778: J1.2 3.99,9.24 X1.RING 5.16,6.27 X1.RING_SW | U$6.GND@0 24.2,43.84 | U$7.GND@0 24.25,27.8 C4.- | 16.41,2.18 S2.2 | C3.- 23.53,41.94 22.23,40.64 20.57,40.64 19.56,39.62 19.56,37.59 19.56,35.31 19.68,35.18 | v71.12,3.81 71.12,6.73
  Bottom 0.406: 65.91,13.08 v65.91,40.01
  Bottom 0.61: U$7.GND 39.49,26.8 v40.39,25.91
  Bottom 0.813: 65.91,13.08 71.12,8.38 v71.12,7.62 v71.12,3.81 | 96.52,8.89 97.03,8.89 98.55,10.41 98.55,29.46 99.06,29.97 99.06,68.76 TFT.1
  Bottom 1.27: U1.GND@0 U1.GND@1
  Bottom 1.422: 24.61,2.18 25.53,1.27 38.02,1.27 U1.GND@0
  Bottom 1.778: S2.2 S2.1 24.61,2.18 | v71.12,3.81 71.12,2.16 70.48,1.52 43.56,1.52 43.18,1.91 U1.GND@1 JP11.5 | U1.GND@0 JP11.4
  pour Top (isolate 0.508): -2.54,-2.54 14.86,-2.54 14.86,29.34 12.45,29.34 12.45,46.74 11.94,46.74 11.94,69.6 22.99,69.6 22.99,64.14 13.59,64.14 13.59,46.86 26.67,46.86 26.67,39.37 18.16,39.37 18.16,30.99 26.8,30.99 26.8,23.11 15.37,23.11 15.37,-2.54 104.14,-2.54 104.14,81.28 -2.54,81.28
  pour Bottom (isolate 0.508): -5.08,83.82 -2.54,-2.54 101.6,-2.54 101.6,83.82
LED
  Top 0.406: JP1.3 28.96,56.68 D13.A
  Top 0.813: U1.D13 JP1.3
N$1
  Top 0.406: U$6.RST U$6.SLP
N$2
  Top 0.305: POWER.A 28.34,5.82 27.56,6.6 27.56,8.19 R41.1
N$3
  Top 0.406: U$6.MS1 27.51,39.37 29.97,39.37 30.99,40.39 30.99,41.4 31.5,41.78 32.51,41.78 33.08,42.48 R5.1 34.36,42.55 36.45,42.55 36.83,42.93 SJ1.2
N$4
  Top 1.778: U$1.2B 19.05,74.04 18.16,74.93 8.13,74.93 6.6,73.41 6.6,52.58 6.22,52.2 JP5.1
  Bottom 1.778: JP5.1 8,52.2 Z-MOT1.1
N$5
  Top 1.778: U$1.2A 21.59,75.06 19.43,77.22 6.73,77.22 3.94,74.42 3.94,66.93 1.91,64.77 1.91,57.22 JP5.2
  Bottom 1.778: Z-MOT1.2 4.37,56.01 JP5.2
N$6  (via drill 0.6)
  Top 1.778: v24.13,67.82 U$1.1A
  Bottom 1.778: JP5.3 4.71,58.55 Z-MOT1.3 10.67,58.55 11.43,59.31 11.43,66.29 12.95,67.82 v24.13,67.82
N$7  (via drill 0.6)
  Top 1.778: v26.54,70.1 26.54,72.26 U$1.1B
  Bottom 1.778: JP5.4 7.66,62.7 Z-MOT1.4 9.27,68.33 11.05,70.1 v26.54,70.1
N$8
  Top 0.406: U$1.RST U$1.SLP
N$9
  Top 0.305: 17.27,63.63 SJ7.2 22.61,64.64 23.37,65.41 29.52,65.41 R1.1
  Top 0.406: U$1.MS1 16.51,62.87 17.27,63.63
N$10  (via drill 0.6)
  Top 0.406: U$6.MS2 26.74,37.15 28.19,38.61 30.23,38.61 v32.26,40.64 | SJ2.2 39.37,43.18 v38.35,42.16
  Bottom 0.406: v32.26,40.64 36.59,40.64 38.11,42.16 v38.35,42.16
N$11
  Top 0.305: 25.4,63.5 SJ8.2 23.88,62.1 19.68,62.1 19.05,61.47 U$1.MS2
N$12  (via drill 0.6)
  Top 0.406: v41.91,42.55 41.91,43.75 SJ5.2
  Bottom 0.406: U$6.MS3 29.46,36.06 31.24,37.85 35.81,37.85 39.37,41.4 41.4,41.4 41.91,41.91 v41.91,42.55
N$13
  Top 0.406: U$7.RST U$7.SLP
N$14
  Top 0.305: SJ9.2 28.12,62.29 27.18,61.34 22.1,61.34 21.59,60.83 U$1.MS3
N$17  (via drill 0.6)
  Top 0.406: SJ4.2 39.37,26.92 38.86,26.42 v38.1,26.42
  Bottom 0.406: U$7.MS2 26.79,20.82 28.32,22.35 30.61,22.35 33.27,25.02 37.07,25.02 38.1,26.05 v38.1,26.42
N$21  (via drill 0.6)
  Top 1.778: v23.11,38.23 26.67,41.78 26.67,48.69 U$6.2B
  Bottom 1.778: JP2.1 5.46,37 X-MOT.1 11.22,37 12.45,38.23 v23.11,38.23
N$22  (via drill 0.6)
  Top 1.778: v29.21,40.77 29.21,48.69 U$6.2A
  Bottom 1.778: JP2.2 4.5,39.54 X-MOT.2 9.56,39.54 13.34,40.77 v29.21,40.77
N$26  (via drill 0.6)
  Top 1.778: v31.88,43.43 31.88,48.7 U$6.1A
  Bottom 1.778: JP2.3 4.59,42.08 X-MOT.3 10.33,42.08 11.68,43.43 v31.88,43.43
N$27  (via drill 0.6)
  Top 0.406: v34.29,46.35 34.36,46.42
  Top 1.778: 34.36,46.42 U$6.1B
  Bottom 1.778: v34.29,46.35 10.5,46.35 X-MOT.4 5.55,44.62 JP2.4
N$28  (via drill 0.6)
  Top 1.778: v22.23,22.86 23.75,22.86 26.8,25.91 U$7.2B
  Bottom 1.778: JP7.1 5.45,20.75 Y-MOT.1 11.86,20.75 13.97,22.86 v22.23,22.86
N$29  (via drill 0.6)
  Top 1.778: v29.34,25.4 U$7.2A
  Bottom 1.778: JP7.2 4.49,23.29 Y-MOT.2 11.35,23.29 13.46,25.4 v29.34,25.4
N$30  (via drill 0.6)
  Top 1.778: v31.88,27.94 U$7.1A
  Bottom 1.778: JP7.3 4.59,25.83 Y-MOT.3 10.59,25.83 12.7,27.94 v31.88,27.94
N$31  (via drill 0.6)
  Top 0.406: v41.91,24.64 SJ6.2
  Bottom 0.406: U$7.MS3 29.92,20.01 33.78,23.88 38.47,23.88 39.23,24.64 v41.91,24.64
N$33  (via drill 0.6)
  Top 0.406: 34.5,27.36 36.25,27.36 SJ3.2 | v32.64,26.29 33.53,27.18 R8.1
  Top 0.813: R8.1 34.5,27.36
  Bottom 0.406: U$7.MS1 24.25,20.19 27.69,23.62 29.97,23.62 v32.64,26.29
N$36  (via drill 0.6)
  Top 1.27: v34.42,30.73 v34.41,30.74
  Top 1.778: v34.41,30.74 U$7.1B
  Bottom 1.778: JP7.4 5.55,28.37 Y-MOT.4 11,30.73 v34.42,30.73
RESET
  Bottom 0.813: U1.RES 27.28,3.89 S2.3 S2.4
  Bottom 1.778: U1.RES JP11.1
SCL
  Top 0.813: U1.D21 JP8.8
SDA
  Top 0.813: U1.D20 JP8.7
SERV1
  Top 0.813: U1.D9 JP1.7
  Bottom 0.305: JP1.7 39.12,55.24 37.97,56.39 36.83,56.39 35.56,57.66 35.56,59.18 36.07,59.69 37.97,59.69 38.73,60.45 38.73,61.85 39.12,62.23 41.02,62.23 41.53,62.74 41.53,74.17 40.64,75.06 38.99,75.06 37.6,73.67 37.6,73.65 SER1.3
SERV2  (via drill 0.6)
  Top 0.305: SER2.3 41.27,72.39 41.27,70.74 | 40.51,69.98 v34.92,69.98
  Top 0.406: 41.27,70.74 40.51,69.98
  Top 0.813: U1.D10 JP1.6
  Bottom 0.305: v34.92,69.98 34.92,60.45 34.29,59.82 34.29,57.02 JP1.6
SPI_MISO  (via drill 0.6)
  Top 0.305: U1.D50 72.31,14.05 69.47,17.02 69.47,27.94 65.91,31.5 65.91,37.08 67.82,38.99 67.82,43.56 62.23,49.28 62.23,56.39 61.09,57.4 57.28,57.4 55.75,58.93 v55.75,59.44 | v54.74,65.91 54.74,67.94 53.21,69.47 53.21,73.41 54.1,74.3 57.4,74.3 58.29,73.41 58.29,71.43 TFT.30
  Bottom 0.305: v55.75,59.44 55.12,59.44 54.74,59.82 v54.74,65.91
SPI_MOSI  (via drill 0.6)
  Top 0.305: U1.D51 96.35,14.05 95,12.83 72.14,12.83 68.33,16.76 68.33,27.94 65.79,30.48 65.15,30.48 63.5,32.13 63.5,38.35 63.25,38.61 62.56,38.61 | 62.3,38.86 59.69,38.86 57.4,41.15 57.4,50.55 57.15,50.8 57.15,55.63 56.26,56.52 55.75,56.52 52.96,59.31 v52.96,60.33
  Top 0.406: 62.56,38.61 RN5.2 62.3,38.86
  Bottom 0.305: v52.96,60.33 52.96,68.6 TFT.34
SPI_SCK  (via drill 0.6)
  Top 0.305: U1.D52 64.69,11.51 63.5,12.7 v63.5,29.46 | v63.5,41.02 63.5,40.13 62.56,40.13 | v59.69,45.09 59.69,56.01 58.93,56.77 56.9,56.77 56.52,57.15 56.13,57.15 53.85,59.44 v53.85,62.36
  Top 0.406: 62.56,40.13 RN5.1
  Bottom 0.305: v63.5,29.46 v63.5,41.02 63.5,41.27 v59.69,45.09 | TFT.32 53.85,66.95 v53.85,62.36
SPI_SS  (via drill 0.6)  (1 unrouted)
  Top 0.305: RN5.3 61.34,37.47 v60.71,36.83 60.71,35.43 62.61,33.53 62.61,12.45 64.77,10.29 95.25,10.29 96.47,11.51 U1.D53 | v51.94,59.31 51.94,58.42 54.61,55.75 54.61,46.35 54.48,46.23 v54.48,36.83
  Bottom 0.305: 51.94,70.1 v51.94,59.31 | v54.48,36.83 v60.71,36.83
TFT_CS
  Top 0.305: 77.54,27.43 75.56,27.43 69.34,33.53 69.34,44.2 65.66,47.88 65.66,61.98 60.83,66.8 60.83,71.63 59.78,72.68
  Top 0.406: 77.54,27.43 RN4.7 | TFT.29 59.78,72.68
TFT_LEDA
  Top 0.305: R26.2 49.44,72.7
  Top 0.406: 49.44,72.7 TFT.37
TFT_RD
  Top 0.305: R13.2 82.38,72.74
  Top 0.406: 82.38,72.74 TFT.11
TFT_REST
  Top 0.305: 77.54,26.16 75.56,26.16 68.58,33.15 68.58,43.81 65.02,47.37 65.02,61.72 61.59,65.15 58.04,65.15 55.75,67.44 55.75,71.5 54.57,72.68
  Top 0.406: 77.54,26.16 RN4.8 | TFT.33 54.57,72.68
TFT_RS  (via drill 0.6)
  Top 0.406: RN2.2 v86.36,61.59
  Bottom 0.305: 87.76,61.59 88.77,62.61 88.77,71.55 TFT.7
  Bottom 0.406: v86.36,61.59 87.76,61.59
TFT_WR  (via drill 0.6)
  Top 0.305: v84.96,62.87 RN2.1
  Bottom 0.305: 84.98,72.66 83.69,71.37 83.69,64.14 v84.96,62.87
  Bottom 0.406: TFT.9 84.98,72.66
VCC  (via drill 0.6)
  Top 0.305: SJ7.1 24.77,64.77 26.42,64.77 | 30.1,62.55 SJ9.1 28.96,63.7 28.96,64.52 28.7,64.77 26.42,64.77 | SJ8.1 26.42,64.77 | 39.37,44.77 SJ2.1 | 36.9,44.9 SJ1.1 | R41.2 36.24,8.21 JP11.3 | SER1.2
  Top 0.406: U$7.VDD 36.95,29.98 36.83,29.86 SJ3.1 SJ4.1 39.43,28.9 SJ6.1 45.15,28.9 45.21,28.96 | 45.72,45.95 45.64,46.03 | 30.1,62.55 R2.1 33.91,62.55 | 33.91,62.55 36,62.55 36.32,62.23 38.73,62.23 JP15.5 | v33.91,63.5 33.91,62.55
  Top 0.61: 45.64,46.03 43.04,46.03 SJ5.1 39.37,44.77 | SER2.2 SER1.2 | SJ1.1 SJ2.1 | U$6.VDD 36.9,44.9
  Top 0.813: 45.21,29.84 45.21,45.82 45.34,45.95 45.72,45.95 46.96,45.95 R19.1 48.32,47.31 | 55.88,45.72 R18.1 | 45.21,22.23 45.34,22.35 | U1.5V@2 U1.5V@1
  Top 1.016: v55.88,43.31 55.88,20.32 48.26,12.7 | v55.88,43.31 55.88,45.72 | v55.88,43.31 R18.1
  Top 1.778: 45.16,29.9 45.21,29.84 45.21,28.96 45.21,22.23 45.21,16.89 48.26,13.84 48.26,12.7 48.26,2.67 47.37,1.78 38.99,1.78 38.1,2.67 U1.5V@0 JP11.3
  Bottom 0.305: 37.26,70.99 SER1.2
  Bottom 0.406: 33.66,66.04 33.91,65.79
  Bottom 0.61: U$6.VDD 36.9,49.46 35.43,50.67 33.4,50.67 32.77,51.44 32.77,58.04 33.66,58.93 33.66,63.25 v33.91,63.5 33.91,65.79 | U$1.VDD 29.21,71.5 29.72,70.99 | 29.72,70.99 37.26,70.99 | 29.72,70.99 29.72,67.18 30.86,66.04 33.66,66.04 | TFT.3 93.85,71.43 93.85,68.96 93.98,68.83 U1.5V@1 88.98,52.15 85.34,48.51 61.09,48.51 v55.88,43.31
VIN  (1 unrouted)
  Bottom 1.27: 13.21,14.73 12.65,14.73 EXT_PWR.1
  Bottom 2.54: U1.VIN 45.72,7.62 38.63,14.71 13.23,14.71 13.21,14.73
X-DIR  (via drill 0.6)
  Top 0.406: v50.8,43.18 U1.D5
  Top 0.813: JP3.3 U1.D5
  Bottom 0.406: U$6.DIR 43.68,36.06 v50.8,43.18
X-EN
  Top 0.813: U1.D3 JP3.5
  Top 1.016: R18.2 U1.D3
  Bottom 0.61: 50.8,40.89 50.8,41.15 55.88,46.23 U1.D3
  Bottom 0.813: U$6.EN 21.66,36 23.62,34.04 47.12,34.04 50.8,37.72 50.8,40.89
X-MAX
  Top 0.813: U1.D17 JP8.4
  Bottom 0.305: JP8.4 73.03,57.91 68.45,57.91 68.07,58.29 50.93,58.29 48.26,60.96 47.62,61.59 40.64,61.59 JP15.3
X-MIN
  Top 0.813: U1.D16 JP8.3
  Bottom 0.305: JP8.3 73.66,55.12 71.63,57.15 68.2,57.15 67.82,57.53 50.55,57.53 47.24,60.83 42.29,60.83 JP15.1
X-STEP
  Top 0.813: JP3.4 U1.D4
  Bottom 0.406: U$6.STEP 36.9,36.9 38.1,38.1 43.18,38.1 49.53,44.32 49.53,44.45 53.34,48.26 U1.D4
Y-DIR  (via drill 0.6)
  Top 0.406: v43.81,32.13 v43.81,40.64
  Top 0.813: U1.D8 JP1.8
  Bottom 0.406: v43.81,40.64 43.81,47.12 41.66,49.28 U1.D8 | v43.81,32.13 43.81,24.34 U$7.DIR
Y-EN  (via drill 0.6)
  Top 0.406: R19.2 49.04,49.13 49.78,48.39 49.78,46.48 48.26,44.96 48.26,31.75 49.53,30.48 49.53,19.05 v48.26,17.78 | 48.26,49.15 U1.D6
  Top 0.813: R19.2 48.26,49.15 | U1.D6 JP3.2
  Bottom 0.406: U$7.EN 21.71,19.44 22.86,18.29 35.81,18.29 37.21,16.89 47.37,16.89 v48.26,17.78
Y-MAX  (via drill 0.6)
  Top 0.406: v43.05,59.69 38.86,59.69 JP15.4
  Top 0.813: U1.D15 JP8.2
  Bottom 0.305: JP8.2 71.12,55.12 69.85,56.39 67.94,56.39 67.56,56.77 50.29,56.77 47.37,59.69 v43.05,59.69
Y-MIN
  Top 0.813: U1.D14 JP8.1
  Bottom 0.305: JP8.1 67.31,56.01 50.04,56.01 47.37,58.67 42.29,58.67 40.89,57.28 38.61,57.28 JP15.2
Y-STEP  (via drill 0.6)
  Top 0.406: v46.61,44.45 46.61,31.5 47.75,30.35 v47.75,25.53
  Top 0.813: U1.D7 JP3.1
  Bottom 0.406: v46.61,44.45 45.72,45.34 U1.D7 | v47.75,25.53 47.24,25.53 39.88,18.16 38.8,18.16 U$7.STEP
Z-DIR  (via drill 0.6)
  Top 0.305: U$1.DIR 34.54,59.69 v35.81,60.96 | v38.73,65.15 42.55,65.15 43.81,66.42 43.81,76.07 45.97,78.23 87.5,78.23 88.77,76.96 88.77,67.69 89.53,66.93 v90.17,66.93 | v89.03,55.75 89.03,50.04 v87.76,48.77 | v81.03,36.96 v81.03,42.67
  Bottom 0.305: U1.D32 92.66,38.23 89.53,38.23 88.27,36.96 CN2.2 v81.03,36.96 | v35.81,60.96 35.81,64.26 36.7,65.15 v38.73,65.15 | v90.17,66.93 89.41,66.17 89.41,58.17 89.03,57.78 v89.03,55.75 | v81.03,42.67 81.66,42.67 v87.76,48.77
Z-EN  (via drill 0.6)
  Top 0.305: 31.75,64.64 34.04,66.93 v35.94,66.93 | v38.73,66.93 42.55,66.93 43.18,67.56 43.18,76.58 45.47,78.87 90.04,78.87 91.44,77.47 v91.44,65.02 | v90.3,56.9 90.3,48.64 v89.41,47.75
  Top 0.406: v30.35,64.39 31.69,64.39 R2.2 31.75,64.64
  Bottom 0.305: CN2.1 88.9,40.77 89.53,40.77 | 89.53,40.77 92.66,40.77 U1.D30 | v35.94,66.93 v38.73,66.93 | v91.44,65.02 90.3,63.88 v90.3,56.9 | v89.41,47.75 89.41,40.89 89.53,40.77
  Bottom 0.406: U$1.EN 13.97,62.23 17.78,66.04 28.7,66.04 v30.35,64.39
Z-STEP  (via drill 0.6)
  Top 0.305: CN1.4 91.82,39.5 93.09,38.23 95.3,38.23 U1.D31 | U$1.STEP 31.24,57.28 42.16,57.28 50.67,65.79 50.67,73.41 52.2,74.93 v77.34,74.93 | v82.55,50.67 80.01,50.67 78.74,49.4 78.74,38.86 v79.38,38.23
  Bottom 0.305: CN1.4 89.66,39.5 88.39,38.23 v79.38,38.23 | v77.34,74.93 78.61,73.66 78.61,59.94 82.55,56.01 v82.55,50.67

### Text on the board
_tsilk: servo | S1 | S2 | S | Y+ | + | - | MOTORC | MS1 | MS2 | MS3 | GND | limits | +V | X+ | Y+ | C | X- | Y+ | + | 1 | MS3 | MOTORA | MS1 | MS2 | A | MS3 | + | MOTORB | MS1 | MS2 | B | Polarshield v1.4 | + | www.polargraph.co.uk | + | + | GND | 2013.08.11 # | + | +
_bsilk: Polarshield v1.4 | www.polargraph.co.uk | + | + | + | GND